# EAGLE schematic EPS (EAGLE 9.5.1), part 2 of 2
## Sheet 11 of 13
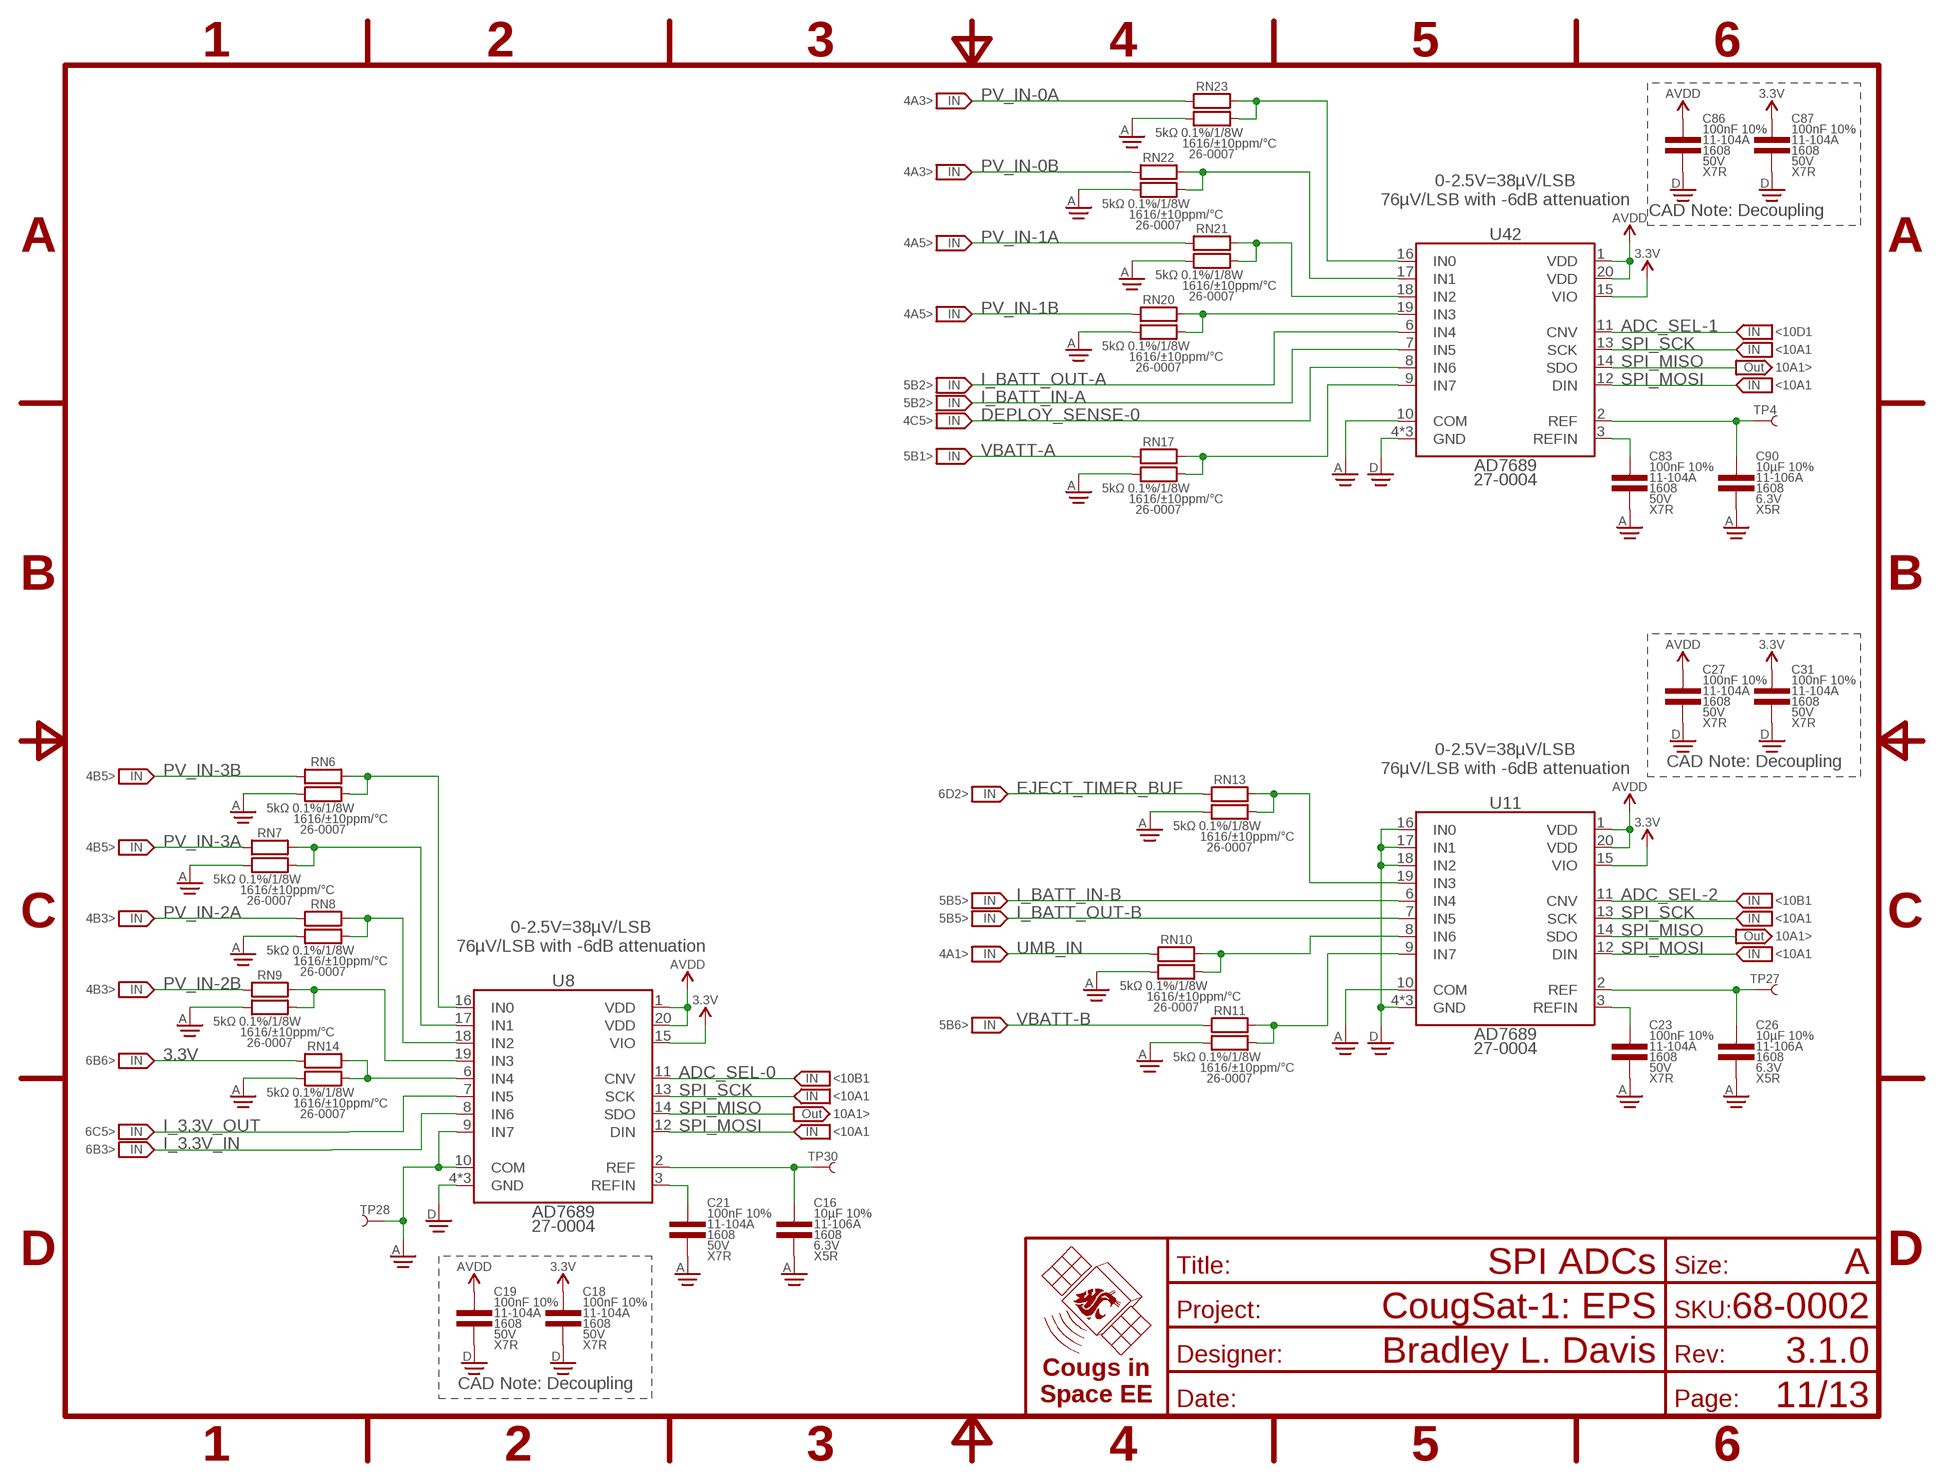
[diagram p10: schematic, sheet 11]
FRAME11 (FRAME-A): TITLE: SPI ADCs

### Parts
C16  10µF 10%  CAP-V-10UF-1608  [1608]
C18  100nF 10%  CAP-V-100NF-1608  [1608]
C19  100nF 10%  CAP-V-100NF-1608  [1608]
C21  100nF 10%  CAP-V-100NF-1608  [1608]
C23  100nF 10%  CAP-V-100NF-1608  [1608]
C26  10µF 10%  CAP-V-10UF-1608  [1608]
C27  100nF 10%  CAP-V-100NF-1608  [1608]
C31  100nF 10%  CAP-V-100NF-1608  [1608]
C83  100nF 10%  CAP-V-100NF-1608  [1608]
C86  100nF 10%  CAP-V-100NF-1608  [1608]
C87  100nF 10%  CAP-V-100NF-1608  [1608]
C90  10µF 10%  CAP-V-10UF-1608  [1608]
RN6  5kΩ 0.1%  RES-H-PAIRED-5K-1616  [1616]
RN7  5kΩ 0.1%  RES-H-PAIRED-5K-1616  [1616]
RN8  5kΩ 0.1%  RES-H-PAIRED-5K-1616  [1616]
RN9  5kΩ 0.1%  RES-H-PAIRED-5K-1616  [1616]
RN10  5kΩ 0.1%  RES-H-PAIRED-5K-1616  [1616]
RN11  5kΩ 0.1%  RES-H-PAIRED-5K-1616  [1616]
RN13  5kΩ 0.1%  RES-H-PAIRED-5K-1616  [1616]
RN14  5kΩ 0.1%  RES-H-PAIRED-5K-1616  [1616]
RN17  5kΩ 0.1%  RES-H-PAIRED-5K-1616  [1616]
RN20  5kΩ 0.1%  RES-H-PAIRED-5K-1616  [1616]
RN21  5kΩ 0.1%  RES-H-PAIRED-5K-1616  [1616]
RN22  5kΩ 0.1%  RES-H-PAIRED-5K-1616  [1616]
RN23  5kΩ 0.1%  RES-H-PAIRED-5K-1616  [1616]
TP4  TEST_POINT-SMD-C-1.25  [SMD-C-1.25]
TP27  TEST_POINT-SMD-C-1.25  [SMD-C-1.25]
TP28  TEST_POINT-SMD-C-1.25  [SMD-C-1.25]
TP30  TEST_POINT-SMD-C-1.25  [SMD-C-1.25]
U8  AD7689  [QFN-20-4040]
U11  AD7689  [QFN-20-4040]
U42  AD7689  [QFN-20-4040]

### Nets
3.3V [power]: C18.1 C31.1 C87.1 RN14.2(B1) U8.15(VIO) U11.15(VIO) U42.15(VIO) ; also sheet 4,6,7,8,9,10,12
ADC_3.3V: RN14.3(B2) RN14.4(A2) U8.6(IN4)
ADC_EJECT_TIMER_BUF: RN13.3(B2) RN13.4(A2) U11.19(IN3)
ADC_PV_IN-0A: RN23.3(B2) RN23.4(A2) U42.16(IN0)
ADC_PV_IN-0B: RN22.3(B2) RN22.4(A2) U42.17(IN1)
ADC_PV_IN-1A: RN21.3(B2) RN21.4(A2) U42.18(IN2)
ADC_PV_IN-1B: RN20.3(B2) RN20.4(A2) U42.19(IN3)
ADC_PV_IN-2A: RN8.3(B2) RN8.4(A2) U8.18(IN2)
ADC_PV_IN-2B: RN9.3(B2) RN9.4(A2) U8.19(IN3)
ADC_PV_IN-3A: RN7.3(B2) RN7.4(A2) U8.17(IN1)
ADC_PV_IN-3B: RN6.3(B2) RN6.4(A2) U8.16(IN0)
ADC_REF-0: C16.1 TP30.1 U8.2(REF)
ADC_REF-1: C90.1 TP4.1 U42.2(REF)
ADC_REF-2: C26.1 TP27.1 U11.2(REF)
ADC_REFIN-0: C21.1 U8.3(REFIN)
ADC_REFIN-1: C83.1 U42.3(REFIN)
ADC_REFIN-2: C23.1 U11.3(REFIN)
ADC_SEL-0: U8.11(CNV) ; also sheet 10
ADC_SEL-1: U42.11(CNV) ; also sheet 10
ADC_SEL-2: U11.11(CNV) ; also sheet 10
ADC_UMB_IN: RN10.3(B2) RN10.4(A2) U11.8(IN6)
ADC_VBATT-A: RN17.3(B2) RN17.4(A2) U42.9(IN7)
ADC_VBATT-B: RN11.3(B2) RN11.4(A2) U11.9(IN7)
AGND [power]: C16.2 C21.2 C23.2 C26.2 C83.2 C90.2 RN6.1(A1) RN7.1(A1) RN8.1(A1) RN9.1(A1) RN10.1(A1) RN11.1(A1) RN13.1(A1) RN14.1(A1) RN17.1(A1) RN20.1(A1) RN21.1(A1) RN22.1(A1) RN23.1(A1) TP28.1 U8.9(IN7) U8.10(COM) U11.10(COM) U42.10(COM) ; also sheet 2,4,5,6,7,8,12
AVDD [power]: C19.1 C27.1 C86.1 U8.1(VDD) U8.20(VDD) U11.1(VDD) U11.20(VDD) U42.1(VDD) U42.20(VDD) ; also sheet 5,6,7,8,10,12
DEPLOY_SENSE-0: U42.8(IN6) ; also sheet 4
DGND [power]: C18.2 C19.2 C27.2 C31.2 C86.2 C87.2 U8.4(GND) U8.5(GND) U8.PAD(GND) U11.4(GND) U11.5(GND) U11.16(IN0) U11.17(IN1) U11.18(IN2) U11.PAD(GND) U42.4(GND) U42.5(GND) U42.PAD(GND) ; also sheet 2,9,10,12
EJECT_TIMER_BUF: RN13.2(B1) ; also sheet 6
I_3.3V_IN: U8.8(IN6) ; also sheet 6
I_3.3V_OUT: U8.7(IN5) ; also sheet 6
I_BATT_IN-A: U42.7(IN5) ; also sheet 5
I_BATT_IN-B: U11.6(IN4) ; also sheet 5
I_BATT_OUT-A: U42.6(IN4) ; also sheet 5
I_BATT_OUT-B: U11.7(IN5) ; also sheet 5
PV_IN-0A [power]: RN23.2(B1) ; also sheet 4
PV_IN-0B [power]: RN22.2(B1) ; also sheet 4
PV_IN-1A [power]: RN21.2(B1) ; also sheet 4
PV_IN-1B [power]: RN20.2(B1) ; also sheet 4
PV_IN-2A [power]: RN8.2(B1) ; also sheet 4
PV_IN-2B [power]: RN9.2(B1) ; also sheet 4
PV_IN-3A [power]: RN7.2(B1) ; also sheet 4
PV_IN-3B [power]: RN6.2(B1) ; also sheet 4
SPI_MISO: U8.14(SDO) U11.14(SDO) U42.14(SDO) ; also sheet 10
SPI_MOSI: U8.12(DIN) U11.12(DIN) U42.12(DIN) ; also sheet 10
SPI_SCK: U8.13(SCK) U11.13(SCK) U42.13(SCK) ; also sheet 10
UMB_IN [power]: RN10.2(B1) ; also sheet 4
VBATT-A [power]: RN17.2(B1) ; also sheet 5
VBATT-B [power]: RN11.2(B1) ; also sheet 5

### Notes on the sheet
- 4A3>
- 4A3>
- 0-2.5V=38µV/LSB
  76µV/LSB with -6dB attenuation
- CAD Note: Decoupling
- 4A5>
- 4A5>
- <10D1
- <10A1
- 10A1>
- 5B2> | <10A1
- 5B2>
- 4C5>
- 5B1>
- 0-2.5V=38µV/LSB
  76µV/LSB with -6dB attenuation
- CAD Note: Decoupling
- 4B5>
- 6D2>
- 4B5>
- 5B5> | <10B1
- 4B3> | 5B5> | <10A1
- 0-2.5V=38µV/LSB
  76µV/LSB with -6dB attenuation
- 10A1>
- 4A1> | <10A1
- 4B3>
- 5B6>
- 6B6>
- <10B1
- <10A1
- 10A1>
- 6C5> | <10A1
- 6B3>
- CAD Note: Decoupling

## Sheet 12 of 13
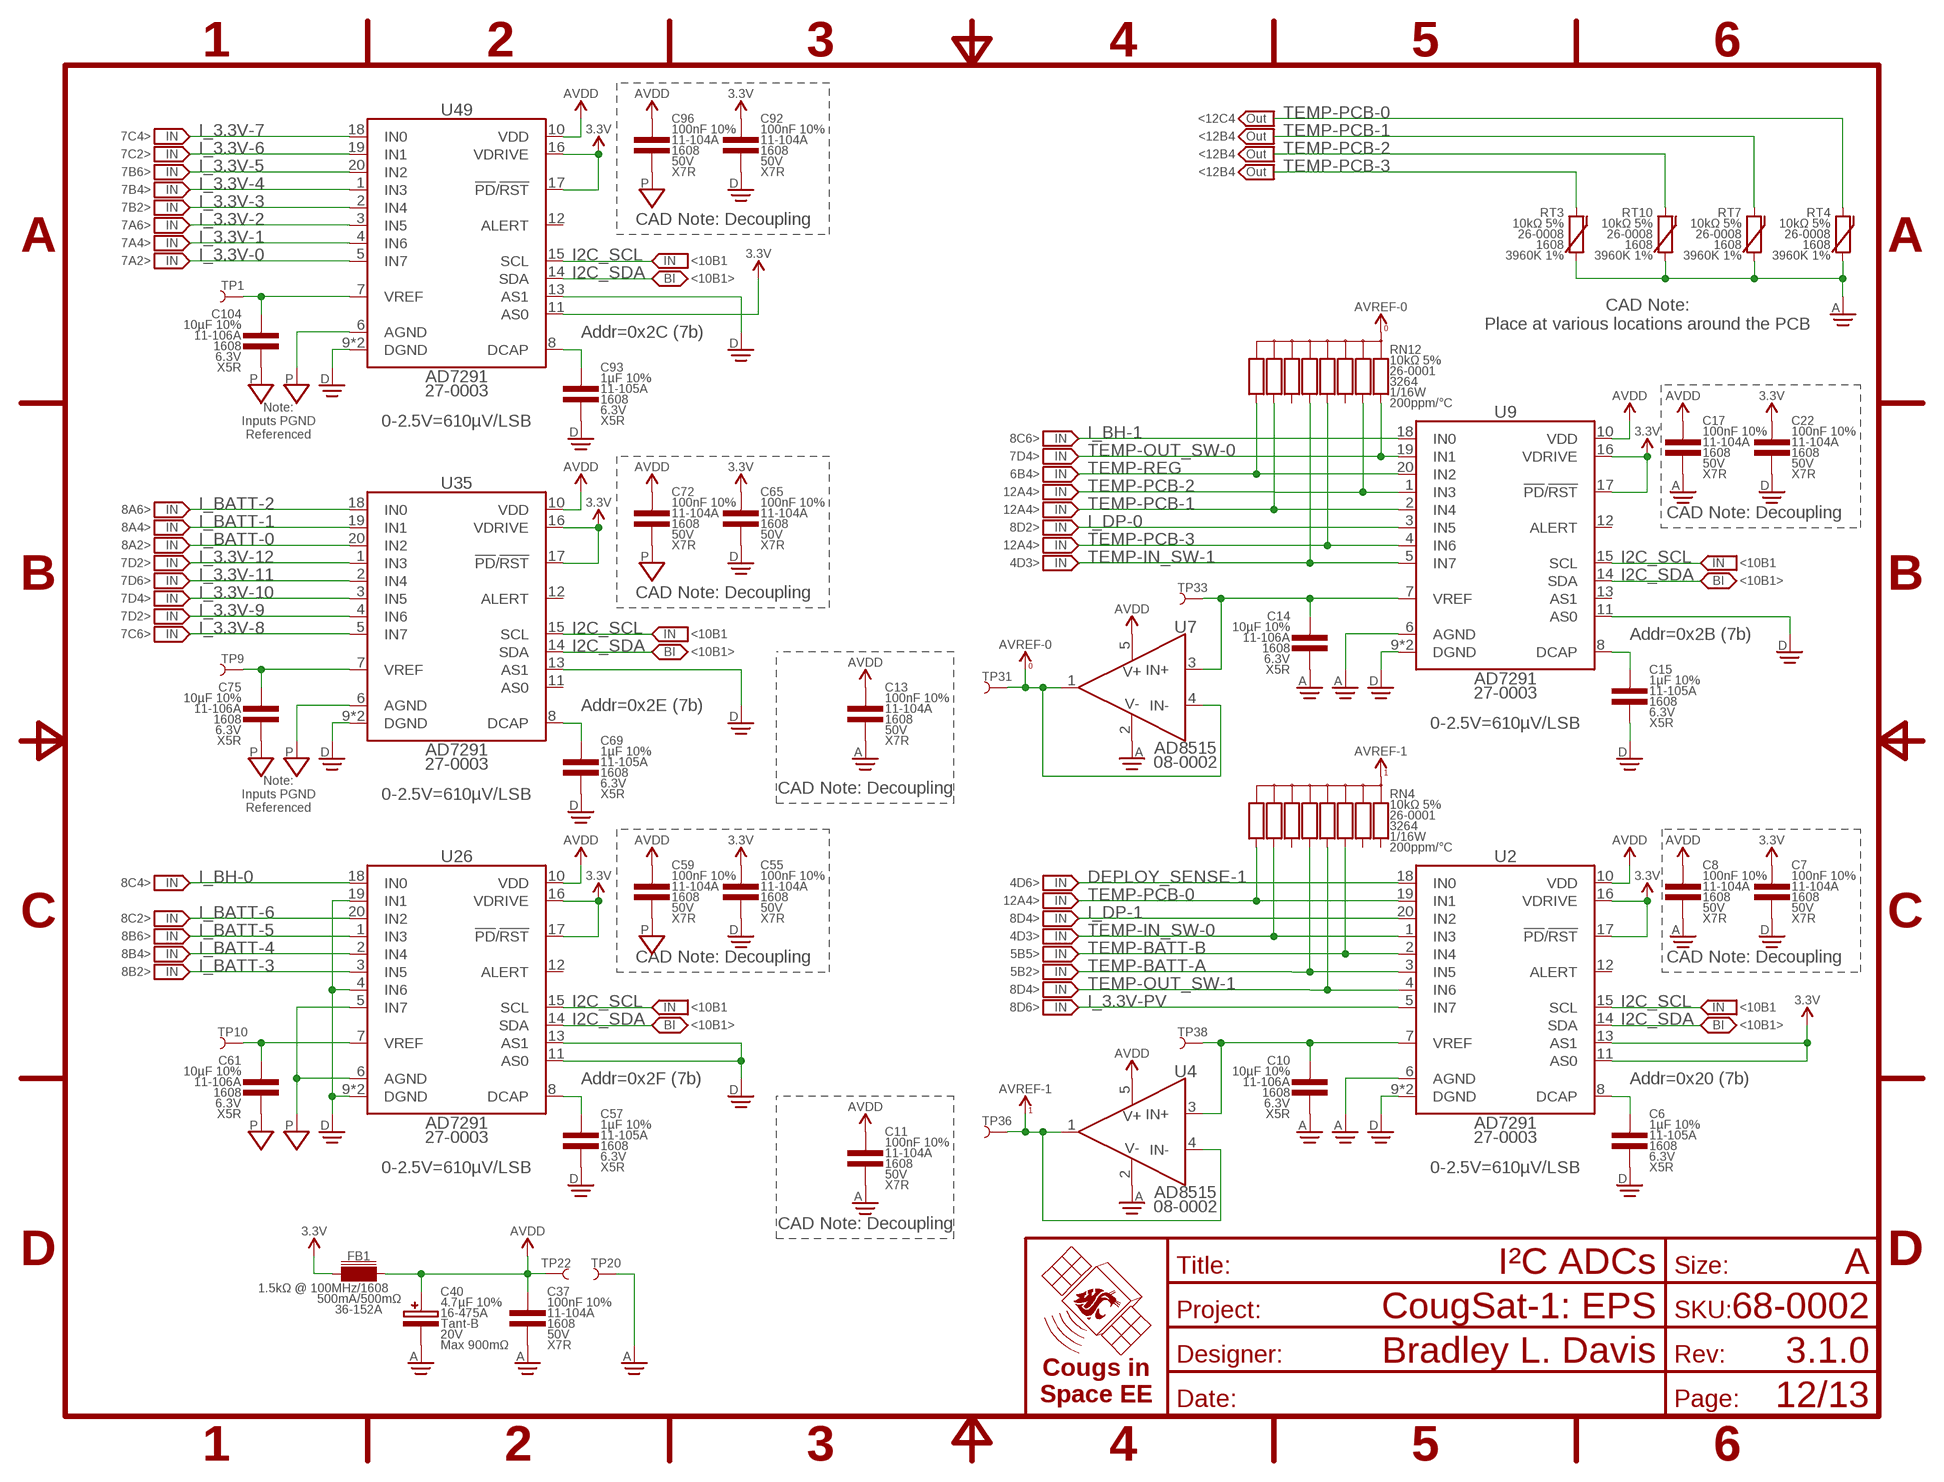
[diagram p11: schematic, sheet 12]
FRAME9 (FRAME-A): TITLE: I²C ADCs

### Parts
C6  1µF 10%  CAP-V-1UF-1608  [1608]
C7  100nF 10%  CAP-V-100NF-1608  [1608]
C8  100nF 10%  CAP-V-100NF-1608  [1608]
C10  10µF 10%  CAP-V-10UF-1608  [1608]
C11  100nF 10%  CAP-V-100NF-1608  [1608]
C13  100nF 10%  CAP-V-100NF-1608  [1608]
C14  10µF 10%  CAP-V-10UF-1608  [1608]
C15  1µF 10%  CAP-V-1UF-1608  [1608]
C17  100nF 10%  CAP-V-100NF-1608  [1608]
C22  100nF 10%  CAP-V-100NF-1608  [1608]
C37  100nF 10%  CAP-V-100NF-1608  [1608]
C40  4.7µF 10%  CAP-POL-V-4.7UF-4028  [4028-POL]
C55  100nF 10%  CAP-V-100NF-1608  [1608]
C57  1µF 10%  CAP-V-1UF-1608  [1608]
C59  100nF 10%  CAP-V-100NF-1608  [1608]
C61  10µF 10%  CAP-V-10UF-1608  [1608]
C65  100nF 10%  CAP-V-100NF-1608  [1608]
C69  1µF 10%  CAP-V-1UF-1608  [1608]
C72  100nF 10%  CAP-V-100NF-1608  [1608]
C75  10µF 10%  CAP-V-10UF-1608  [1608]
C92  100nF 10%  CAP-V-100NF-1608  [1608]
C93  1µF 10%  CAP-V-1UF-1608  [1608]
C96  100nF 10%  CAP-V-100NF-1608  [1608]
C104  10µF 10%  CAP-V-10UF-1608  [1608]
FB1  1.5kΩ @ 100MHz  CHOKE-H-1.5K-1608  [1608]
RN4  10kΩ 5%  RES_BUS-10-10K-3264  [3264]
RN12  10kΩ 5%  RES_BUS-10-10K-3264  [3264]
RT3  10kΩ 5%  THERMISTOR-V-10K-1608  [1608]
RT4  10kΩ 5%  THERMISTOR-V-10K-1608  [1608]
RT7  10kΩ 5%  THERMISTOR-V-10K-1608  [1608]
RT10  10kΩ 5%  THERMISTOR-V-10K-1608  [1608]
TP1  TEST_POINT-SMD-C-1.25  [SMD-C-1.25]
TP9  TEST_POINT-SMD-C-1.25  [SMD-C-1.25]
TP10  TEST_POINT-SMD-C-1.25  [SMD-C-1.25]
TP20  TEST_POINT-SMD-C-1.25  [SMD-C-1.25]
TP22  TEST_POINT-SMD-C-1.25  [SMD-C-1.25]
TP31  TEST_POINT-SMD-C-1.25  [SMD-C-1.25]
TP33  TEST_POINT-SMD-C-1.25  [SMD-C-1.25]
TP36  TEST_POINT-SMD-C-1.25  [SMD-C-1.25]
TP38  TEST_POINT-SMD-C-1.25  [SMD-C-1.25]
U2  AD7291  [QFN-20-4040]
U4  AD8515  OPAMP-1-AD8515  [SOT23-5]
U7  AD8515  OPAMP-1-AD8515  [SOT23-5]
U9  AD7291  [QFN-20-4040]
U26  AD7291  [QFN-20-4040]
U35  AD7291  [QFN-20-4040]
U49  AD7291  [QFN-20-4040]

### Nets
3.3V [power]: C7.1 C22.1 C55.1 C65.1 C92.1 FB1.1 U2.11(AS0) U2.13(AS1) U2.16(VDRIVE) U2.17(!PD!/!RST) U9.16(VDRIVE) U9.17(!PD!/!RST) U26.16(VDRIVE) U26.17(!PD!/!RST) U35.16(VDRIVE) U35.17(!PD!/!RST) U49.11(AS0) U49.16(VDRIVE) U49.17(!PD!/!RST) ; also sheet 4,6,7,8,9,10,11
ADC_DCAP-3: C93.1 U49.8(DCAP)
ADC_DCAP-4: C69.1 U35.8(DCAP)
ADC_DCAP-5: C57.1 U26.8(DCAP)
ADC_DCAP-6: C15.1 U9.8(DCAP)
ADC_DCAP-7: C6.1 U2.8(DCAP)
ADC_REF-3: C104.1 TP1.1 U49.7(VREF)
ADC_REF-4: C75.1 TP9.1 U35.7(VREF)
ADC_REF-5: C61.1 TP10.1 U26.7(VREF)
ADC_REF-6: C14.1 TP33.1 U7.3(IN+) U9.7(VREF)
ADC_REF-7: C10.1 TP38.1 U2.7(VREF) U4.3(IN+)
AGND [power]: C8.2 C10.2 C11.2 C13.2 C14.2 C17.2 C37.2 C40.C RT3.1 RT4.1 RT7.1 RT10.1 TP20.1 U2.6(AGND) U4.2(V-) U7.2(V-) U9.6(AGND) ; also sheet 2,4,5,6,7,8,11
AVDD [power]: C8.1 C11.1 C13.1 C17.1 C37.1 C40.A C59.1 C72.1 C96.1 FB1.2 TP22.1 U2.10(VDD) U4.5(V+) U7.5(V+) U9.10(VDD) U26.10(VDD) U35.10(VDD) U49.10(VDD) ; also sheet 5,6,7,8,10,11
AVREF-0 [power]: RN12.5(C) RN12.10(C) TP31.1 U7.1(OUT) U7.4(IN-)
AVREF-1 [power]: RN4.5(C) RN4.10(C) TP36.1 U4.1(OUT) U4.4(IN-)
DEPLOY_SENSE-1: U2.18(IN0) ; also sheet 4
DGND [power]: C6.2 C7.2 C15.2 C22.2 C55.2 C57.2 C65.2 C69.2 C92.2 C93.2 U2.9(DGND) U2.PAD(DGND) U9.9(DGND) U9.11(AS0) U9.PAD(DGND) U26.4(IN6) U26.9(DGND) U26.11(AS0) U26.13(AS1) U26.19(IN1) U26.PAD(DGND) U35.9(DGND) U35.13(AS1) U35.PAD(DGND) U49.9(DGND) U49.13(AS1) U49.PAD(DGND) ; also sheet 2,9,10,11
I2C_SCL: U2.15(SCL) U9.15(SCL) U26.15(SCL) U35.15(SCL) U49.15(SCL) ; also sheet 10
I2C_SDA: U2.14(SDA) U9.14(SDA) U26.14(SDA) U35.14(SDA) U49.14(SDA) ; also sheet 10
I_3.3V-0: U49.5(IN7) ; also sheet 7
I_3.3V-1: U49.4(IN6) ; also sheet 7
I_3.3V-2: U49.3(IN5) ; also sheet 7
I_3.3V-3: U49.2(IN4) ; also sheet 7
I_3.3V-4: U49.1(IN3) ; also sheet 7
I_3.3V-5: U49.20(IN2) ; also sheet 7
I_3.3V-6: U49.19(IN1) ; also sheet 7
I_3.3V-7: U49.18(IN0) ; also sheet 7
I_3.3V-8: U35.5(IN7) ; also sheet 7
I_3.3V-9: U35.4(IN6) ; also sheet 7
I_3.3V-10: U35.3(IN5) ; also sheet 7
I_3.3V-11: U35.2(IN4) ; also sheet 7
I_3.3V-12: U35.1(IN3) ; also sheet 7
I_3.3V-PV: U2.5(IN7) ; also sheet 8
I_BATT-0: U35.20(IN2) ; also sheet 8
I_BATT-1: U35.19(IN1) ; also sheet 8
I_BATT-2: U35.18(IN0) ; also sheet 8
I_BATT-3: U26.3(IN5) ; also sheet 8
I_BATT-4: U26.2(IN4) ; also sheet 8
I_BATT-5: U26.1(IN3) ; also sheet 8
I_BATT-6: U26.20(IN2) ; also sheet 8
I_BH-0: U26.18(IN0) ; also sheet 8
I_BH-1: U9.18(IN0) ; also sheet 8
I_DP-0: U9.3(IN5) ; also sheet 8
I_DP-1: U2.20(IN2) ; also sheet 8
PGND [power]: C59.2 C61.2 C72.2 C75.2 C96.2 C104.2 U26.5(IN7) U26.6(AGND) U35.6(AGND) U49.6(AGND) ; also sheet 2,4,5,6,7,8,9
TEMP-BATT-A: RN4.6 U2.3(IN5) ; also sheet 5
TEMP-BATT-B: RN4.3 U2.2(IN4) ; also sheet 5
TEMP-IN_SW-0: RN4.8 U2.1(IN3) ; also sheet 4
TEMP-IN_SW-1: RN12.6 U9.5(IN7) ; also sheet 4
TEMP-OUT_SW-0: RN12.1 U9.19(IN1) ; also sheet 7
TEMP-OUT_SW-1: RN4.4 U2.4(IN6) ; also sheet 8
TEMP-PCB-0: RN4.9 RT4.2 U2.19(IN1)
TEMP-PCB-1: RN12.8 RT7.2 U9.2(IN4)
TEMP-PCB-2: RN12.2 RT10.2 U9.1(IN3)
TEMP-PCB-3: RN12.4 RT3.2 U9.4(IN6)
TEMP-REG: RN12.9 U9.20(IN2) ; also sheet 6
Unconnected: RN4.1 RN4.2 RN4.7 RN12.3 RN12.7 U2.12(ALERT) U9.12(ALERT) U9.13(AS1) U26.12(ALERT) U35.11(AS0) U35.12(ALERT) U49.12(ALERT)

### Notes on the sheet
- <12C4
- 7C4> | <12B4
- 7C2> | <12B4
- 7B6> | <12B4
- 7B4>
- 7B2>
- 7A6> | CAD Note: Decoupling
- 7A4>
- 7A2> | <10B1
- <10B1>
- CAD Note:
  Place at various locations around the PCB
- Addr=0x2C (7b)
- Note:
  Inputs PGND
  Referenced
- 0-2.5V=610µV/LSB
- 8C6>
- 7D4>
- 6B4>
- 12A4>
- 8A6> | 12A4>
- CAD Note: Decoupling
- 8A4> | 8D2>
- 8A2> | 12A4>
- 7D2> | 4D3> | <10B1
- 7D6> | <10B1>
- 7D4> | CAD Note: Decoupling
- 7D2>
- 7C6> | <10B1 | Addr=0x2B (7b)
- <10B1>
- Addr=0x2E (7b)
- 0-2.5V=610µV/LSB
- Note:
  Inputs PGND
  Referenced
- 0-2.5V=610µV/LSB | CAD Note: Decoupling
- 8C4> | 4D6>
- 12A4>
- 8C2> | 8D4>
- 8B6> | 4D3>
- 8B4> | 5B5>
- CAD Note: Decoupling | CAD Note: Decoupling
- 8B2> | 5B2>
- 8D4>
- <10B1 | 8D6> | <10B1
- <10B1> | <10B1>
- Addr=0x2F (7b) | Addr=0x20 (7b)
- 0-2.5V=610µV/LSB | 0-2.5V=610µV/LSB
- CAD Note: Decoupling

## Sheet 13 of 13
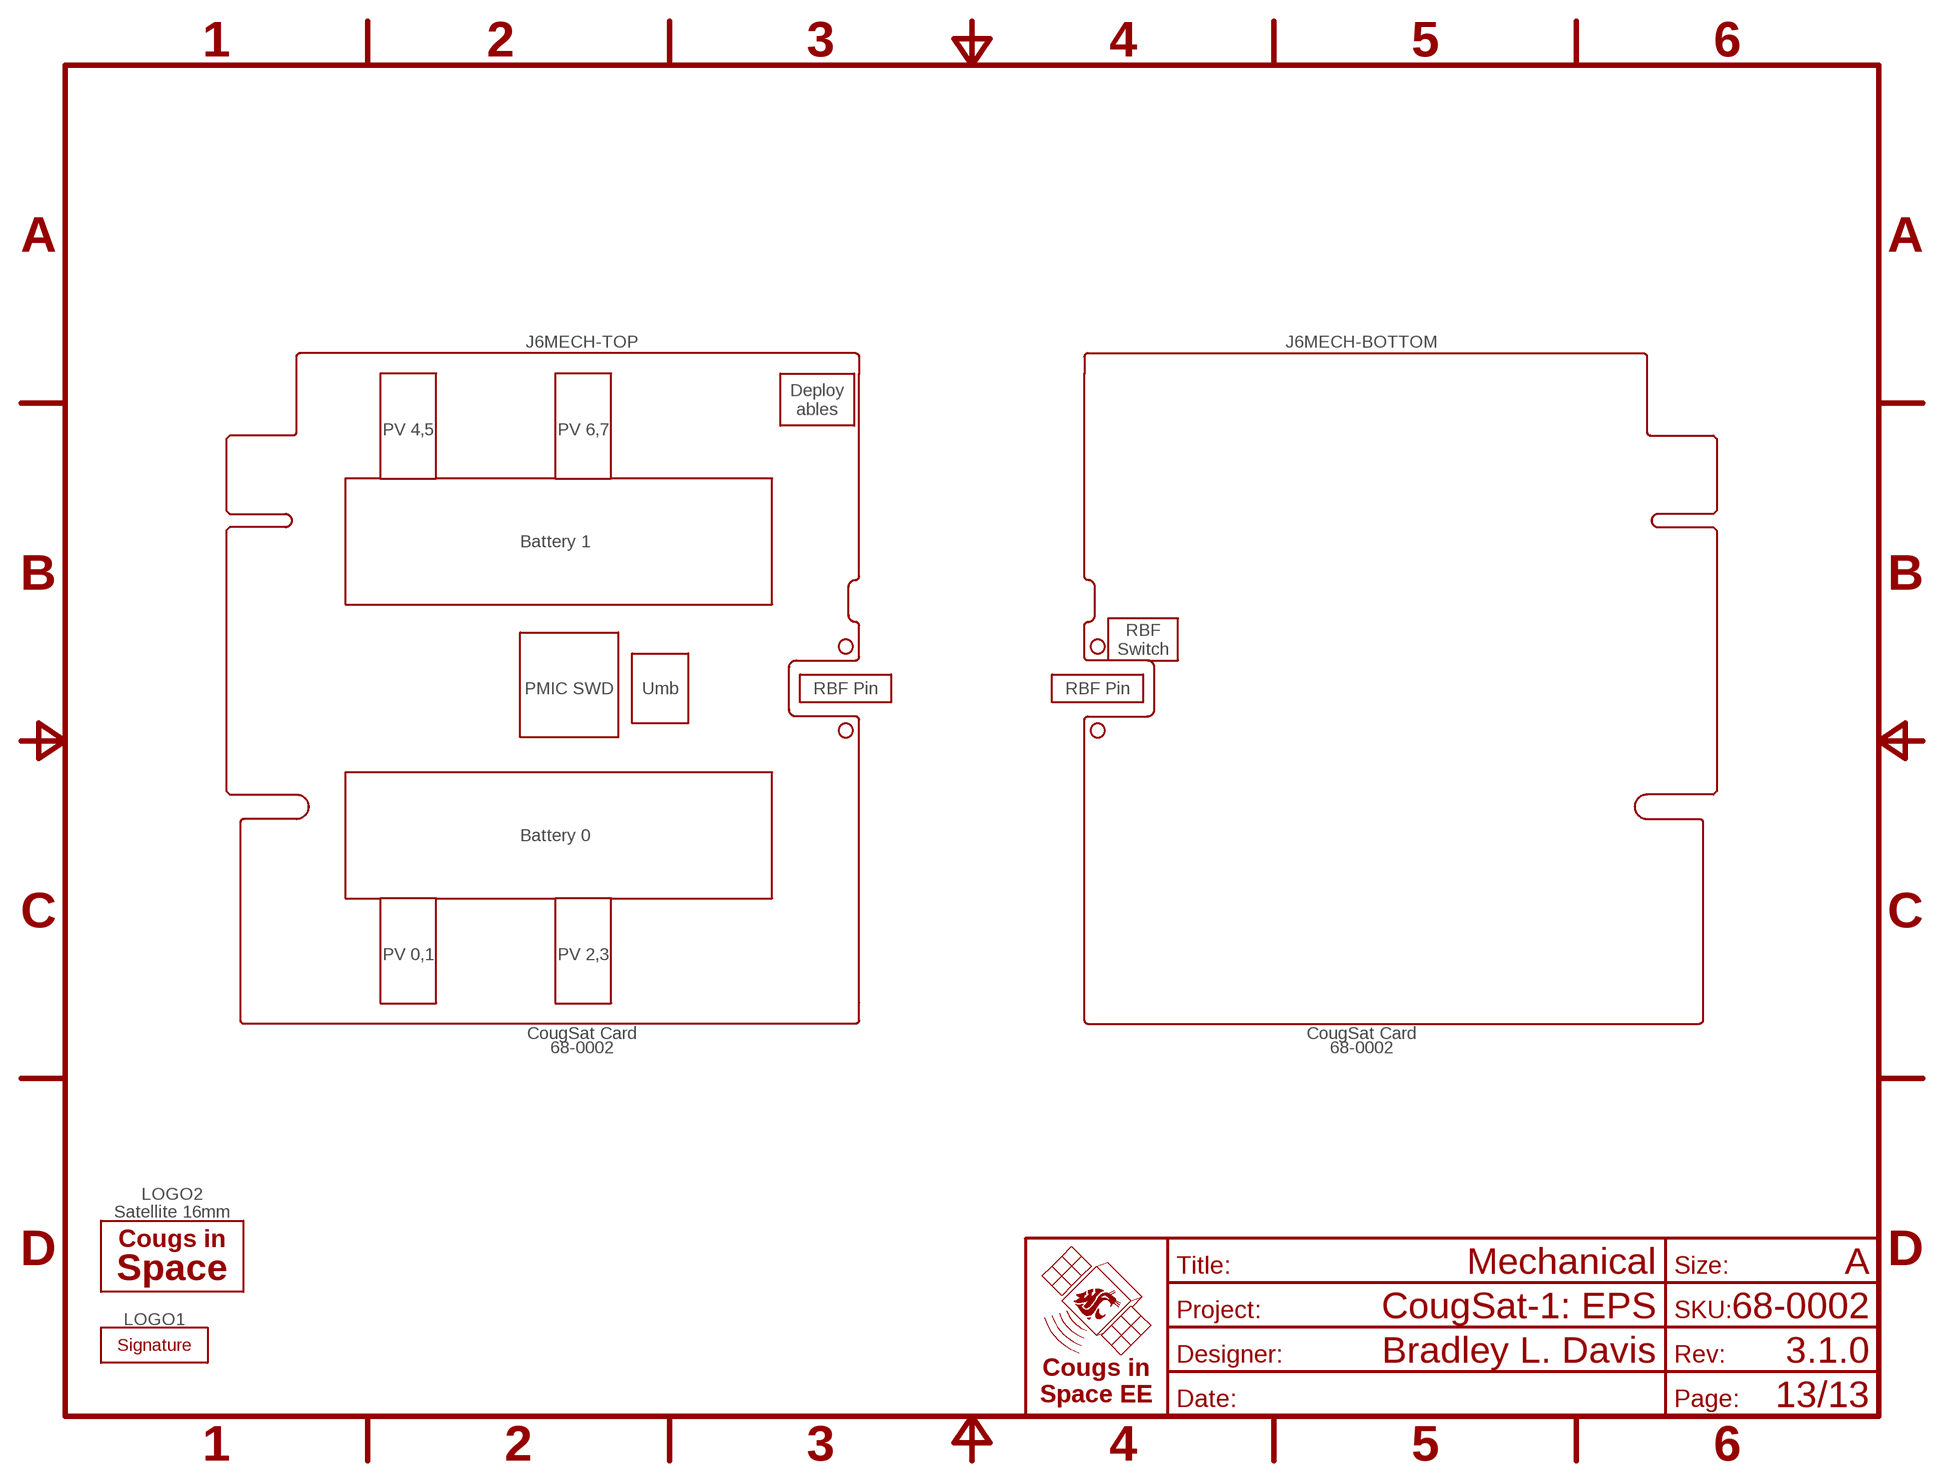
[diagram p12: schematic, sheet 13]
FRAME7 (FRAME-A): TITLE: Mechanical

### Parts
LOGO1  SIGNATUREBRADLEY  [SIGN-BRADLEY]
LOGO2  Satellite 16mm  CIS-LOGO-SATELLITE-16MM  [CIS-SATELLITE-16]

### Notes on the sheet
- Deploy
  ables
- PV 4,5 | PV 6,7
- Battery 1
- RBF
  Switch
- PMIC SWD | Umb | RBF Pin | RBF Pin
- Battery 0
- PV 0,1 | PV 2,3

## Library data of the parts
BT1 BT2 = CougsInSpace-Energy:BATTERY-?*: Battery - 1 Cell 18650HG2 <https://github.com/CougsInSpace/Resources/blob/master/SupplierDocuments/LG/Battery%2018650HG2.pdf>; CAPACITY: 12Wh; SKU: 01-0002
C1-C6 C9 C15 C43 C44 C57 C69 C93 C97-C102 = CougsInSpace-Capacitors:CAP-V: Capacitor - Vertical Orientation; PACKAGE: 1608; SKU: 11-105A; TEMP: X5R; VOLTAGE: 6.3V
C7 C8 C11-C13 C17-C25 C27 C30-C32 C34 C35 C37-C39 C41 C47 C48 C50 C51 C55 C59 C65 C72 C74 C77 C78 C81 C83 C85-C87 C91 C92 C96 = CougsInSpace-Capacitors:CAP-V: Capacitor - Vertical Orientation; PACKAGE: 1608; SKU: 11-104A; TEMP: X7R; VOLTAGE: 50V
C10 C14 C16 C26 C52-C54 C56 C58 C60-C62 C70 C71 C73 C75 C76 C79 C80 C82 C84 C88-C90 C94 C95 C103 C104 = CougsInSpace-Capacitors:CAP-V: Capacitor - Vertical Orientation; PACKAGE: 1608; SKU: 11-106A; TEMP: X5R; VOLTAGE: 6.3V
C28 C29 C42 C46 = CougsInSpace-Capacitors:CAP-V: Capacitor - Vertical Orientation; PACKAGE: 3216; SKU: 13-106A; TEMP: X7R; VOLTAGE: 10V
C33 C49 = CougsInSpace-Capacitors:CAP-POL-V: Capacitor Polarized - Vertical Orientation; ESR: Max 80mΩ; PACKAGE: Tant-C; SKU: 16-227A; VOLTAGE: 6.3V
C36 = CougsInSpace-Capacitors:CAP-V: Capacitor - Vertical Orientation; PACKAGE: 1608; SKU: 11-471A; TEMP: C0G; VOLTAGE: 50V
C40 = CougsInSpace-Capacitors:CAP-POL-V: Capacitor Polarized - Vertical Orientation; ESR: Max 900mΩ; PACKAGE: Tant-B; SKU: 16-475A; VOLTAGE: 20V
C45 = CougsInSpace-Capacitors:CAP-V: Capacitor - Vertical Orientation; PACKAGE: 1608; SKU: 11-4.7A; TEMP: C0G; VOLTAGE: 50V
C63 C64 = CougsInSpace-Capacitors:CAP-V: Capacitor - Vertical Orientation; PACKAGE: 1608; SKU: 11-8.0A; TEMP: C0G; VOLTAGE: 50V
C66 = CougsInSpace-Capacitors:CAP-V: Capacitor - Vertical Orientation; PACKAGE: 1608; SKU: 11-103A; TEMP: X7R; VOLTAGE: 50V
C67 C68 = CougsInSpace-Capacitors:CAP-V: Capacitor - Vertical Orientation; PACKAGE: 1608; SKU: 11-150A; TEMP: C0G; VOLTAGE: 100V
D1-D4 D6-D10 = CougsInSpace-DiscreteSemi:MAX40200: MAX40200 Ideal diode (transistor acting as a diode); CURRENT: 1A; SKU: 60-0015
D5 = CougsInSpace-DiscreteSemi:DIODE-SCHOTTKY-V: Diode Schottky Vertical; CURRENT: 1A; SKU: 51-0002; VF: F-0.45V; VR: R-20V
DS1 = CougsInSpace-LEDs:LED-V: LED Vertical; CURRENT: 20mA; PACKAGE: 1608; SKU: 63-0004; VF: 3.3V
DS2 = CougsInSpace-LEDs:LED-V: LED Vertical; CURRENT: 20mA; PACKAGE: 1608; SKU: 63-0001; VF: 2.2V
DS3 = CougsInSpace-LEDs:LED-V: LED Vertical; CURRENT: 20mA; PACKAGE: 1608; SKU: 63-0003; VF: 2.1V
FB1 = CougsInSpace-Coils:CHOKE-H: Choke (Ferrite Bead) Horizontal; CURRENT: 500mA; DCR: 500mΩ; PACKAGE: 1608; SKU: 36-152A
H1-H4 = CougsInSpace-Hardware:MOUNTING_HOLE: Mounting Hole; SKU: 48-003x
J1 J5 J12 = CougsInSpace-Connectors:1X04: Generic Connector - 4 Conductor; PACKAGE: PicoLock; SKU: 04-0001
J2 J3 J10 J11 = CougsInSpace-Connectors:1X07: Generic Connector - 7 Conductor; PACKAGE: PicoLock; SKU: 04-0007
J4 J7-J9 = CougsInSpace-Connectors:1X01: Generic Connector - 1 Conductor; PACKAGE: THT Ø1.5mm; SKU: 00-0000; VALUE: [Override]
J6 = CougsInSpace-Boards:CIS_CARD-OPEN+X: CougSat Card - Open +X; SKU: 68-0002
J13 = CougsInSpace-Connectors:SWD: Serial Wire Debug; PACKAGE: SMD-6-R; SKU: 04-0004
L1 = CougsInSpace-Coils:INDUCTOR-H: Inductor Horizontal; CURRENT: 9A; DCR: 30.00mΩ; PACKAGE: 7575; SKU: 34-472A
LOGO1 = CougsInSpace-Aesthetics:SIGNATURE: Designer's (Artist's) Signature
LOGO2 = CougsInSpace-Aesthetics:CIS-LOGO: Cougs in Space Artwork These are the Cougs in Space logos and mission patches
Q1 Q2 = CougsInSpace-DiscreteSemi:MOSFET_DUAL_COM_D-N: N-Channel MOSFET - Dual Common Drain; CURRENT: 11.5A; RDS: 6.4mΩ; SKU: 56-0005; VDS: 20V
Q3 Q5-Q8 Q10-Q12 Q14 Q17 Q19 Q20 Q22 Q23 Q25 Q26 Q28 Q29 Q31-Q33 Q35 Q36 Q38 Q39 Q41 Q42 = CougsInSpace-DiscreteSemi:MOSFET-P: P-Channel MOSFET; CURRENT: -15A; RDS: 13.3mΩ; SKU: 56-0002; VDS: -20V
Q4 Q9 Q13 Q15 Q16 Q18 Q21 Q24 Q27 Q30 Q34 Q37 Q40 Q43 = CougsInSpace-DiscreteSemi:MOSFET_DUAL-N: P-Channel MOSFET Array - 2; CURRENT: 250mA; RDS: 2.5Ω; SKU: 56-0007; VDS: 50V
R1 R2 R7 R8 R43 = CougsInSpace-Resistors:RES-H-KELVIN: Resistor Horizontal - Kelvin Connection; PACKAGE: 3216; POWER: 1/2W; SKU: 23-12m0; TEMP: 35ppm/°C
R3 R5 = CougsInSpace-Resistors:RES-V: Resistor Vertical; PACKAGE: TO-220; POWER: 30W; SKU: 25-10.0; TEMP: -55~150°C
R4 R6 R20 = CougsInSpace-Resistors:RES-V: Resistor Vertical; PACKAGE: 3216; POWER: 1/2W; SKU: 23-0.01; TEMP: 75ppm/°C
R9 R23 R67 R92 = CougsInSpace-Resistors:RES-H: Resistor Horizontal; PACKAGE: 1608; POWER: 1/10W; SKU: 21-0000; TEMP: 70°C Max 2A
R10 R14 R17 R18 R39 R45 R47 R51 R54 R56 R58 R60 R62 R64 R66 R69 R71 R73 R75 R77 R79 R81 R83 R86 R88 R90 = CougsInSpace-Resistors:RES-V-KELVIN: Resistor Vertical - Kelvin Connection; PACKAGE: 3216; POWER: 1/2W; SKU: 23-12m0; TEMP: 35ppm/°C
R11 = CougsInSpace-Resistors:RES-H: Resistor Horizontal; PACKAGE: 1608; POWER: 1/8W; SKU: 21-1002; TEMP: 25ppm/°C
R12 R13 R16 R22 R46 R48 R50 R53 R55 R57 R59 R61 R63 R65 R68 R70 R72 R74 R76 R78 R80 R82 R85 R87 R89 R91 = CougsInSpace-Resistors:RES-V: Resistor Vertical; PACKAGE: 1608; POWER: 1/8W; SKU: 21-1002; TEMP: 25ppm/°C
R15 R30 R34 R84 = CougsInSpace-Resistors:RES-V: Resistor Vertical; PACKAGE: 1608; POWER: 1/8W; SKU: 21-1001; TEMP: 25ppm/°C
R19 R44 = CougsInSpace-Resistors:RES-H: Resistor Horizontal; PACKAGE: 1608; POWER: 1/10W; SKU: 21-4754; TEMP: 100ppm/°C
R21 R24 R32 R33 R38 R40 R42 R49 = CougsInSpace-Resistors:RES-V: Resistor Vertical; PACKAGE: 1608; POWER: 1/10W; SKU: 21-0000; TEMP: 70°C Max 2A
R25 = CougsInSpace-Resistors:RES-V: Resistor Vertical; PACKAGE: 1608; POWER: 1/10W; SKU: 21-1500; TEMP: 100ppm/°C
R26 R41 = CougsInSpace-Resistors:RES-V: Resistor Vertical; PACKAGE: 1608; POWER: 1/10W; SKU: 21-4754; TEMP: 100ppm/°C
R27 R35 = CougsInSpace-Resistors:RES-V: Resistor Vertical; PACKAGE: 1608; POWER: 1/10W; SKU: 21-2201; TEMP: 100ppm/°C
R28 R37 = CougsInSpace-Resistors:RES-V: Resistor Vertical; PACKAGE: 1608; POWER: 1/8W; SKU: 21-3300; TEMP: 50ppm/°C
R29 = CougsInSpace-Resistors:RES-V: Resistor Vertical; PACKAGE: 1608; POWER: 1/8W; SKU: 21-1583; TEMP: 25ppm/°C
R31 = CougsInSpace-Resistors:RES-V: Resistor Vertical; PACKAGE: 1608; POWER: 1/10W; SKU: 21-3603; TEMP: 100ppm/°C
R36 = CougsInSpace-Resistors:RES-V: Resistor Vertical; PACKAGE: 1608; POWER: 1/10W; SKU: 21-6203; TEMP: 100ppm/°C
R52 = CougsInSpace-Resistors:RES-H: Resistor Horizontal; PACKAGE: 1608; POWER: 1/8W; SKU: 21-1003; TEMP: 25ppm/°C
RN1 RN2 RN5 = CougsInSpace-Resistors:RES-4-V: Resistor Array - 4 - Vertical; PACKAGE: 1632; POWER: 1/16W; SKU: 26-0000; TEMP: 100ppm/°C
RN3 RN16 = CougsInSpace-Resistors:RES-V-PAIRED: Resistor Vertical - Two Paired Elements; PACKAGE: 1616; POWER: 1/8W; SKU: 26-0007; TEMP: ±10ppm/°C
RN4 RN12 RN15 RN18 RN19 = CougsInSpace-Resistors:RES_BUS-10: Resistor Bussed Array All resistors share a common terminal; PACKAGE: 3264; POWER: 1/16W; SKU: 26-0001; TEMP: 200ppm/°C
RN6-RN11 RN13 RN14 RN17 RN20-RN23 = CougsInSpace-Resistors:RES-H-PAIRED: Resistor Horizontal - Two Paired Elements; PACKAGE: 1616; POWER: 1/8W; SKU: 26-0007; TEMP: ±10ppm/°C
RT1-RT4 RT7 RT10 = CougsInSpace-Resistors:THERMISTOR-V: Thermistor Vertical; B2585: 3960K 1%; PACKAGE: 1608; SKU: 26-0008
RT5 RT6 RT8 RT9 RT11 = CougsInSpace-Resistors:THERMISTOR-H: Thermistor Horizontal; B2585: 3960K 1%; PACKAGE: 1608; SKU: 26-0008
SW1 = CougsInSpace-Switches:SWITCH-SPDT-MOM: Single Pole Dual Throw (SPDT) - Momentary; SKU: 49-0004
TP1-TP38 = CougsInSpace-Connectors:TEST_POINT: Test Point Used to probe points in a circuit for debugging or general measurement
U1 U3 U12 U13 U23-U25 U27-U34 U36-U39 U43-U48 U50 U51 = CougsInSpace-IC-Amplifiers:INA199: INA199 Current-sense amplifier; GAIN: 100 V/V; SKU: 08-0004
U2 U9 U26 U35 U49 = CougsInSpace-IC-Conversion:AD7291: AD7291 12b ADC with 8-single ended channels. I²C interface; SKU: 27-0003
U4 U7 U17 = CougsInSpace-IC-Amplifiers:OPAMP-1: Operational Amplifier - Single; SKU: 08-0002
U5 U14 U15 U19 U20 = CougsInSpace-IC-Comms:LEVEL_SHIFTER-2BIT: Logic Level Shifter Bidirectional - 2b; SKU: 09-0001
U6 U10 U22 U40 = CougsInSpace-IC-Amplifiers:INA199: INA199 Current-sense amplifier; GAIN: 50 V/V; SKU: 08-0003
U8 U11 U42 = CougsInSpace-IC-Conversion:AD7689: AD7689 16b ADC with 8 single-ended or 4 differential channels. SPI interface; SKU: 27-0004
U16 U21 = CougsInSpace-IC-Power:BQ297*: Li-Ion Battery Protection BQ297xx <https://github.com/CougsInSpace/Resources/blob/master/SupplierDocuments/Ti/BQ2970.pdf>; OCC: -0.1V; OCCDELAY: 8ms; OCD: 0.1V; OCDDELAY: 20ms; OVP: 4.275V; OVPDELAY: 1.25s; SCD: 0.5V; SCDDELAY: 250µs; SKU: 60-0006; UVP: 2.8V; UVPDELAY: 144ms
U18 = CougsInSpace-IC-Power:TPS6420*: DC/DC Converter Buck TPS6420x <https://github.com/CougsInSpace/Resources/blob/master/SupplierDocuments/Ti/TPS64200_BuckController.pdf>; MIN-OFF: 600ns; MIN-ON: 1.6µs; SKU: 60-0004
U41 = CougsInSpace-IC-µController:STM32-64P-?*: STM 32b µController - 64 Pin STM32L476Rx <https://github.com/CougsInSpace/Resources/blob/master/SupplierDocuments/ST/STM32L476.pdf> STM32L496Rx <https://github.com/CougsInSpace/Resources/blob/master/SupplierDocuments/ST/STM32L496.pdf>; EXTRAPIN: PD2; FLASH: 1MB; SKU: 61-0002
Y1 = CougsInSpace-Clocks:CRYSTAL: Crystal; LOADCAP: 12.5pF; SKU: 40-323A
Y2 = CougsInSpace-Clocks:CRYSTAL-GROUNDED: Crystal Grounded; LOADCAP: 10pF; SKU: 40-805A

## Net classes
1 power: width 0.2 mm